# EAGLE design sensorCO2LinearSupply (EAGLE 6.6.0)
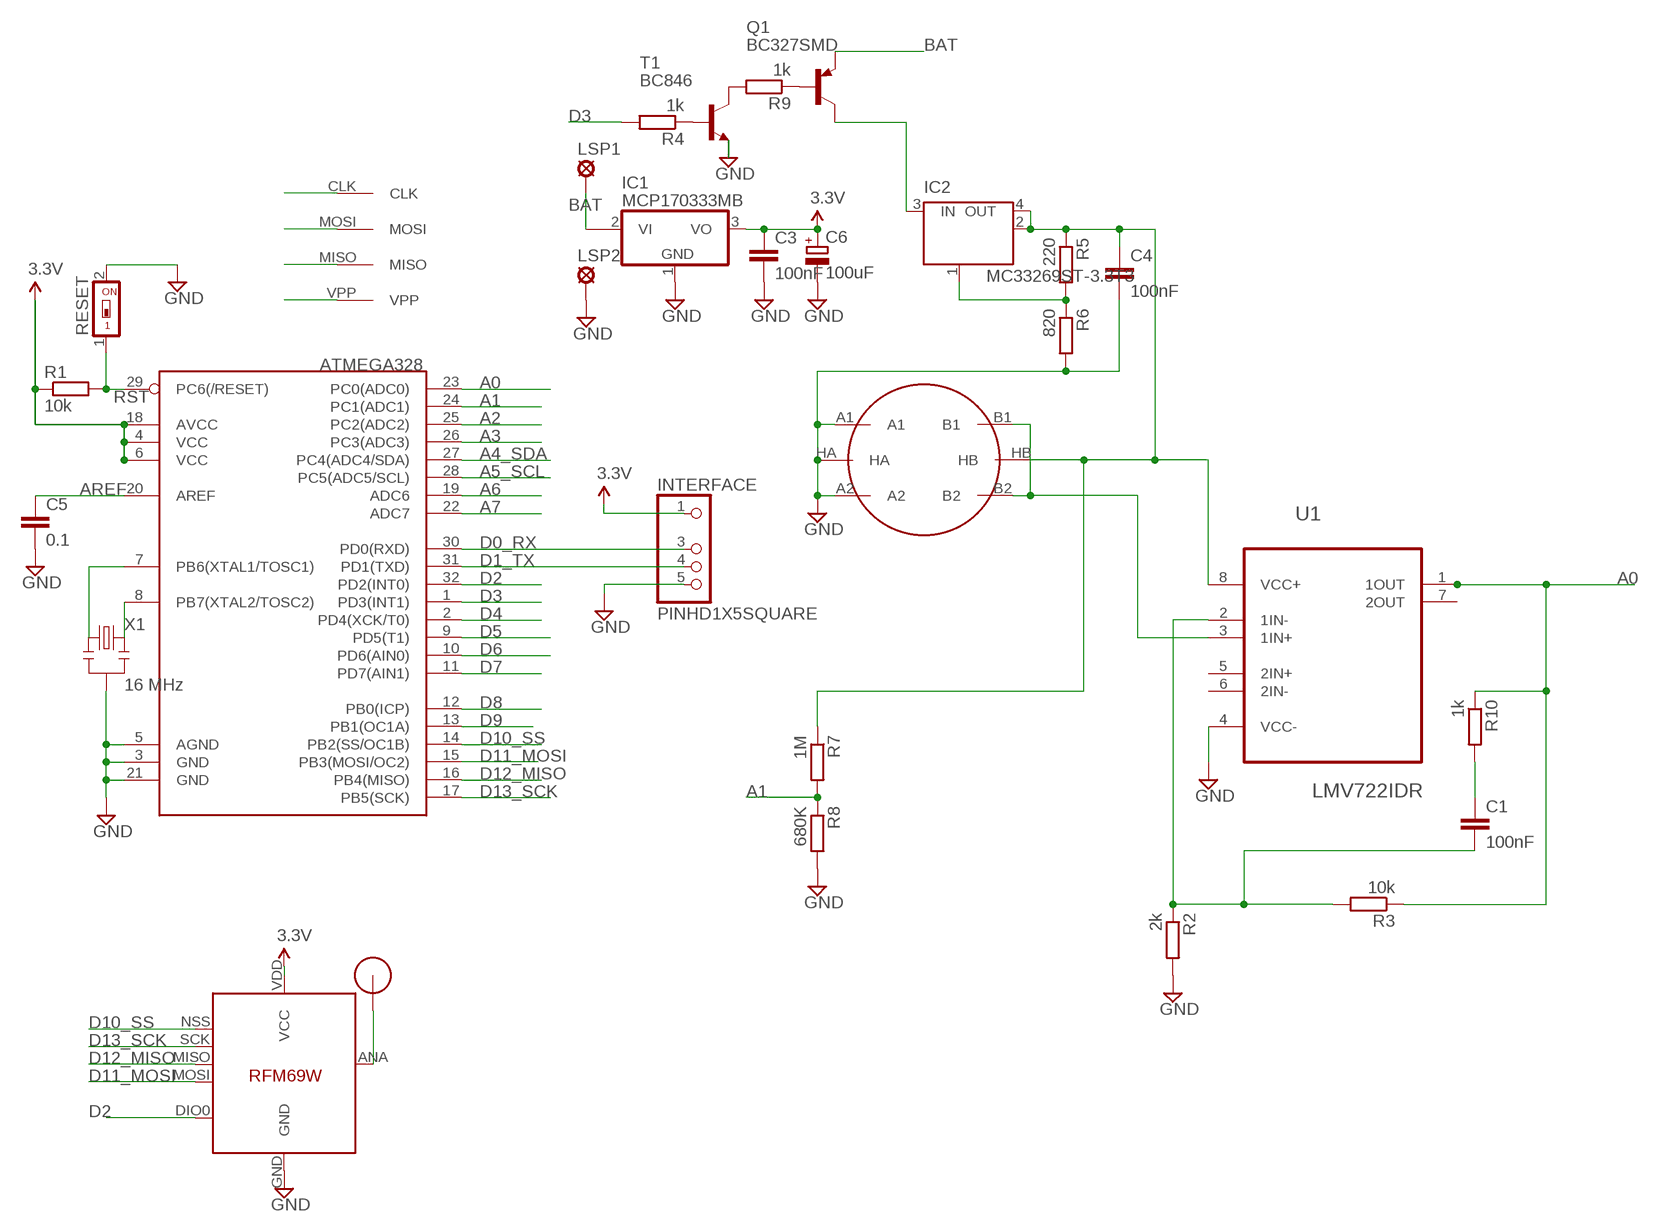
[diagram p0: schematic, sheet 1]

## Parts
ATMEGA328  ATMega-328  ATMEGA168/328TQFP32  [TQFP32-08]
C1  100nF  C-EUC2012  [C2012]
C3  100nF  C-EUC2012  [C2012]
C4  100nF  C-EUC2012  [C2012]
C5  0.1  C-EUC2012  [C2012]
C6  100uF  CPOL-EUSMCB  [SMC_B]
IC1  MCP170333MB  [SOT89]
IC2  MC33269ST-3.3T3  [SOT223]
IC4  RFM69  [RFM69W-MINPADS]
INTERFACE  PINHD1X5SQUARE  [PINHD1X05-SQUARE]
LSP1  LSP11  [LSP11]
LSP2  LSP11  [LSP11]
Q1  BC327SMD  [SOT23-BEC]
R1  10k  R-EU_R2012  [R2012]
R2  2k  R-EU_R2012  [R2012]
R3  10k  R-EU_R2012  [R2012]
R4  1k  R-EU_R2012  [R2012]
R5  220  R-EU_R2012  [R2012]
R6  820  R-EU_R2012  [R2012]
R7  1M  R-EU_R2012  [R2012]
R8  680K  R-EU_R2012  [R2012]
R9  1k  R-EU_R2012  [R2012]
R10  1k  R-EU_R2012  [R2012]
RESET  SWS001  [SMS-001]
T1  BC846  [SOT23]
U1  LMV722IDR  [SOIC127P600X175-8N]
U$1  RFM12B_ANTENNA  [RFM12B-ANTENNA]
U$2  AVRHEADERDIP  [AVRHEADER]
U$4  METHANE_SENSOR  [MQ-3]
X1  16 MHz  RESONATORSMD  [RESONATOR-SMD]

## Nets
6V: C4.1 IC2.2(OUT) IC2.4(OUT) R5.1 R7.1 U1.8(VCC+) U$4.HB
A0: ATMEGA328.23(PC0(ADC0)) R3.1 R10.1 U1.1(1OUT)
A1: ATMEGA328.24(PC1(ADC1)) R7.2 R8.1
A2: ATMEGA328.25(PC2(ADC2))
A3: ATMEGA328.26(PC3(ADC3))
A4_SDA: ATMEGA328.27(PC4(ADC4/SDA))
A5_SCL: ATMEGA328.28(PC5(ADC5/SCL))
A6: ATMEGA328.19(ADC6)
A7: ATMEGA328.22(ADC7)
AREF: ATMEGA328.20(AREF) C5.1
BAT: IC1.2@1(VI1) LSP1.MP Q1.E
D0_RX: ATMEGA328.30(PD0(RXD)) INTERFACE.3
D1_TX: ATMEGA328.31(PD1(TXD)) INTERFACE.4
D2: ATMEGA328.32(PD2(INT0)) IC4.DIO0
D3: ATMEGA328.1(PD3(INT1)) R4.2
D4: ATMEGA328.2(PD4(XCK/T0))
D5: ATMEGA328.9(PD5(T1))
D6: ATMEGA328.10(PD6(AIN0))
D7: ATMEGA328.11(PD7(AIN1))
D8: ATMEGA328.12(PB0(ICP))
D9: ATMEGA328.13(PB1(OC1A))
D10_SS: ATMEGA328.14(PB2(SS/OC1B)) IC4.NSS(SEL)
D11_MOSI: ATMEGA328.15(PB3(MOSI/OC2)) IC4.MOSI U$2.MOSI
D12_MISO: ATMEGA328.16(PB4(MISO)) IC4.MISO U$2.MISO
D13_SCK: ATMEGA328.17(PB5(SCK)) IC4.SCK U$2.CLK
GND: ATMEGA328.3(GND) ATMEGA328.5(AGND) ATMEGA328.21(GND) C3.2 C4.2 C5.2 C6.- IC1.1(GND) IC4.GND INTERFACE.5 LSP2.MP R2.2 R6.2 R8.2 RESET.2 T1.2(E) U1.4(VCC-) U$4.A1 U$4.A2 U$4.HA X1.2
N$1: ATMEGA328.7(PB6(XTAL1/TOSC1)) X1.1
N$2: IC2.1(GND/ADJ) R5.2 R6.1
N$3: IC4.ANA(ANT) U$1.P$1
N$4: IC2.3(IN) Q1.C
N$6: C1.1 R10.2
N$7: U1.3(1IN+) U$4.B1 U$4.B2
N$8: R4.1 T1.1(B)
N$9: R9.2 T1.3(C)
N$10: Q1.B R9.1
N$11: C1.2 R2.1 R3.2 U1.2(1IN-)
N$21: ATMEGA328.8(PB7(XTAL2/TOSC2)) X1.3
RST: ATMEGA328.29(PC6(/RESET)) R1.2 RESET.1 U$2.VPP
VCC: ATMEGA328.4(VCC) ATMEGA328.6(VCC) ATMEGA328.18(AVCC) C3.1 C6.+ IC1.3(VO) IC4.VDD(VCC) INTERFACE.1 R1.1 ; supply symbol labelled 3.3V
Unconnected: IC1.2(VI) U1.5(2IN+) U1.6(2IN-) U1.7(2OUT)

## Library data of the parts
ATMEGA328 = LowPowerLab:ATMEGA168/328: Atmel 32-pin 8-bit micro, 16k flash.
C1 C3-C5 = resistor:C-EU: CAPACITOR, European symbol
C6 = resistor:CPOL-EU: POLARIZED CAPACITOR, European symbol
IC1 = linear:MCP1703*: 250 mA, 16V, Low Quiescent Current LDO Regulator Source: http://ww1.microchip.com/downloads/en/DeviceDoc/22049b.pdf
IC2 = linear:MC33269ST*: Adjustable Output Low Dropout Voltage Regulator 800 mA Source: http://www.onsemi.com/pub/Collateral/MC33269-D.PDF
IC4 = LowPowerLab:RFM69
INTERFACE = eagle-library-edeca.net-v5:PINHD1X5
LSP1 LSP2 = solpad:LSP11: SOLDER PAD drill 1.1 mm
Q1 = transistor-pnp:BC327*: PNP Transistror
R1-R10 = resistor:R-EU_: RESISTOR, European symbol
RESET = smd-special:SWS001: SMD Dip Switch 1 pol.
T1 = transistor:BC846: NPN TRANSISTOR
U1 = Texas Instruments_By_element14_Batch_1:LMV722IDR: OPERATIONAL AMPLIFIERS; MPN: LMV722IDR; OC_FARNELL: -; OC_NEWARK: 02M3640; PACKAGE: SOIC-8; SUPPLIER: Texas Instruments
U$1 = LowPowerLab:RFM12B_ANTENNA
U$2 = RemoteHome:AVRHEADER
U$4 = SparkFun-Sensors:METHANE_SENSOR: MQ-4 Methane Gas Sensor SEN-09404
X1 = SparkFun:RESONATOR: Resonator Small SMD resonator. This is the itty bitty 10/20MHz resonators with built in caps. CSTCE10M0G55 and CSTCE20M0V53. Footprint has been reviewed closely but hasn't been tested yet.

## Net classes
1 power: width 0.381 mm, clearance 0.254 mm

## Board
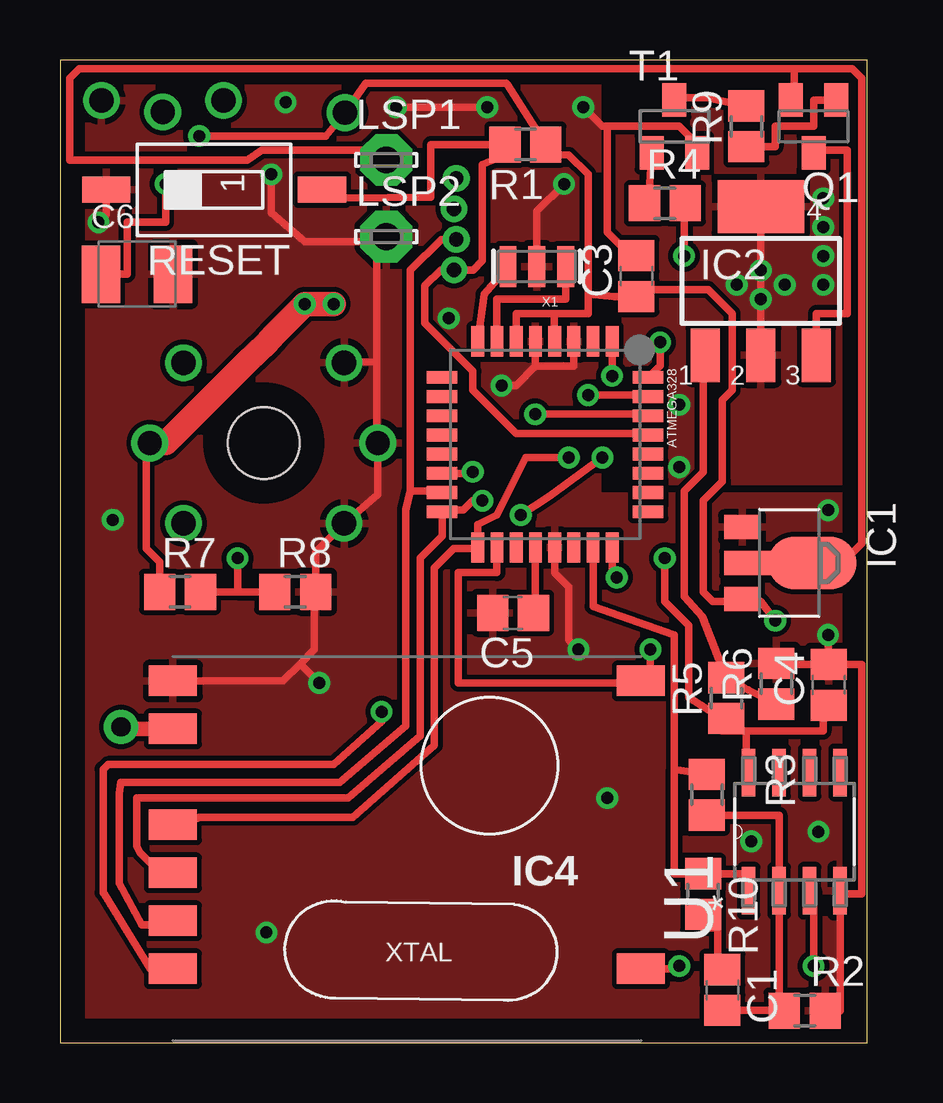
[diagram p1: board, top side]
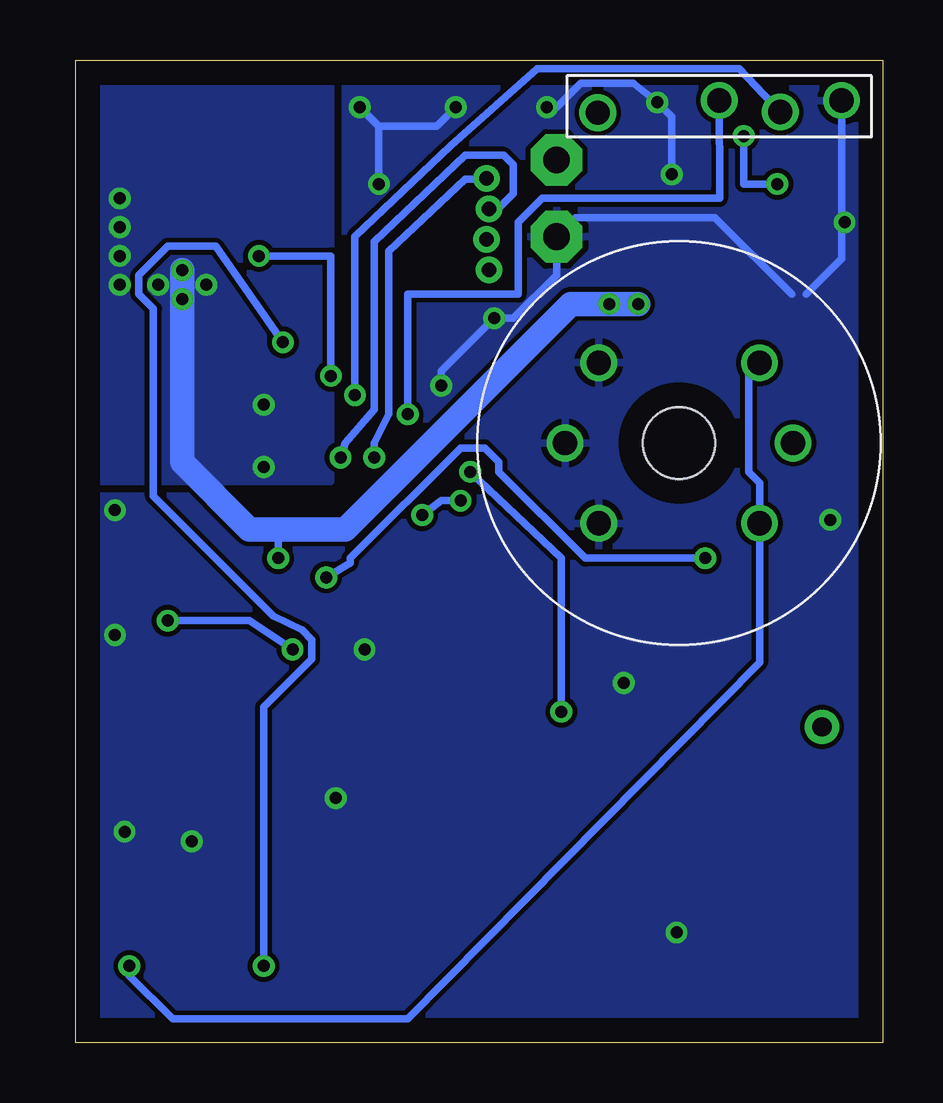
[diagram p2: board, bottom side, seen from below]

Size 33.63 x 40.97 mm. Coordinates in mm from the lower left corner, seen from the top.
Outline: 0,0 33.63,0 33.63,40.97 0,40.97 0,0
Copper layers (1*16): Top 0.035mm / dielectric 1.5mm / Bottom 0.035mm
Design rules "default": minimum track width 10mil, minimum drill 24mil, track to track 8mil, track to pad 8mil, pad to pad 8mil, via to via 8mil, smd to smd 8mil, copper to edge 40mil, drill to drill 8mil, minimum pad ring 10mil, minimum via ring 8mil, stop-mask expansion 4mil, vias tented up to drill 0mil, thermal gap 10mil

### Footprints (pad centres in the part's own frame; a part is rotated, then mirrored left to right if it is on the bottom)
TQFP32-08 = smd 1.27 x 0.533: 1 -4.293,2.8; 2 -4.293,2; 3 -4.293,1.2; 4 -4.293,0.4; 5 -4.293,-0.4; 6 -4.293,-1.2; 7 -4.293,-2; 8 -4.293,-2.8; 17 4.293,-2.8; 18 4.293,-2; 19 4.293,-1.2; 20 4.293,-0.4; 21 4.293,0.4; 22 4.293,1.2; 23 4.293,2; 24 4.293,2.8 | smd 0.533 x 1.27: 9 -2.8,-4.293; 10 -2,-4.293; 11 -1.2,-4.293; 12 -0.4,-4.293; 13 0.4,-4.293; 14 1.2,-4.293; 15 2,-4.293; 16 2.8,-4.293; 25 2.8,4.293; 26 2,4.293; 27 1.2,4.293; 28 0.4,4.293; 29 -0.4,4.293; 30 -1.2,4.293; 31 -2,4.293; 32 -2.8,4.293
C2012 = smd 1.3 x 1.5: 1 -0.85,0; 2 0.85,0
SMC_B = smd 1.6 x 2.4: + -1.5,0; - 1.5,0
SOT89 = smd 1 x 1.5: 1 -1.499,-1.981; 3 1.499,-1.981 | smd 1 x 2: 2 0,-1.727 | smd 2.2 x 3.7: 2@1 0,0.94
SOT223 = smd 1.219 x 2.235: 1 -2.311,-3.099; 2 0,-3.099; 3 2.311,-3.099 | smd 3.6 x 2.2: 4 0,3.099
RFM69W-MINPADS = smd 2 x 1.27: ANA 8,-5; DIO0 -11.5,5; GND 8,-7; MISO 8,1; MOSI 8,3; NSS 8,5; SCK 8,-1; VDD -11.5,-7
PINHD1X05-SQUARE = drill 1.016: 1 -5.061,-0.269; 3 0,0.24; 4 2.54,-0.24; 5 5.099,0.24
LSP11 = drill 1.118 pad 2.159 octagon: MP 0,0
SOT23-BEC = smd 1 x 1.4: B -0.95,-1.1; C 0,1.1; E 0.95,-1.1
R2012 = smd 1.3 x 1.5: 1 -0.85,0; 2 0.85,0
SMS-001 = smd 1.092 x 2.007: 1 0,-4.496; 2 0,4.496
SOT23 = smd 1 x 1.4: 1 -0.95,-1.1; 2 0.95,-1.1; 3 0,1.1
SOIC127P600X175-8N = smd 1.981 x 0.559: 1 -2.464,1.905; 2 -2.464,0.635; 3 -2.464,-0.635; 4 -2.464,-1.905; 5 2.464,-1.905; 6 2.464,-0.635; 7 2.464,0.635; 8 2.464,1.905
RFM12B-ANTENNA = drill 0.8 pad 1.422: P$1 0,0
AVRHEADER = drill 0.6 pad 0.813: CLK 2.54,0; MISO 1.27,0.091; MOSI 0,0; VPP -1.27,0.099
MQ-3 = drill 1.016: A1 -3.35,3.35; A2 -3.35,-3.35; B1 3.35,3.35; B2 3.35,-3.35; HA -4.75,0; HB 4.75,0 | hole 3: 0,0
RESONATOR-SMD = smd 0.7 x 1.7: 1 -1.2,0; 2 0,0; 3 1.2,0

### Placement (x,y rotation side)
ATMEGA328  20.21,24.94 270 top
C1  27.6,2.2 270 top
C3  24.02,31.96 90 top
C4  32.03,14.92 90 top
C5  18.88,17.92 180 top
C6  3.21,32.04 0 top
IC1  30.4,20 270 top
IC2  29.2,31.76 0 top
IC4  12.7,8.09 180 top
INTERFACE  6.82,39.04 0 bottom
LSP1  13.6,36.8 0 top
LSP2  13.6,33.6 0 top
Q1  31.4,38.2 180 top
R1  19.39,37.44 180 top
R2  31.03,1.34 0 top
R3  26.95,10.34 270 top
R4  25.2,35 0 top
R5  27.77,14.37 90 top
R6  29.85,14.97 90 top
R7  5,18.8 0 top
R8  9.8,18.8 0 top
R9  28.6,38.2 90 top
R10  26.8,6.2 270 top
RESET  6.42,35.56 90 top
T1  25.6,38.2 0 top
U1  30.6,8.8 90 top
U$1  2.54,13.17 0 top
U$2  16.51,33.49 90 top
U$4  8.49,25 0 bottom
X1  19.87,32.36 180 top

### Tracks (layer width: path | path; a pad name or v marks a point on that pad's centre or on a via)
6V  (via drill 0.5)
  Top 0.305: IC2.2 v29.2,31 v29.2,32.2 IC2.4 | C4.1 31.8,14.07 31.8,13 28.6,13 | 28.6,13 27.57,13 R5.1 27.28,13.72 26.2,14.4 26.2,17.4 25.2,18.4 v25.2,20.2 | U1.8 28.6,11.26 28.6,13 | R7.1 4.15,20.05 3.6,20.6 3.6,24.86 U$4.HB
  Top 1.016: v11.4,30.8 v10.2,30.8 8.95,29.55 8.6,29.15 7.8,28.4 4.4,25 U$4.HB
  Bottom 0.305: v25.2,20.2 25.2,21.4
  Bottom 1.016: v29.2,32.2 v29.2,31 29.2,24.2 26.4,21.4 25.2,21.4 22.4,21.4 13,30.8 v11.4,30.8 v10.2,30.8
  other vias: 28.2,31.6 30.2,31.6 31.8,35.2 31.8,34 31.8,32.8 31.8,31.6 25.8,26.6 25.8,24
  pour Top: 23,23.4 33.4,23.4 33.4,40.8 23,40.8
  pour Bottom: 33.4,40.8 23,40.8 23,23.4 33.4,23.4
A0
  Top 0.305: ATMEGA328.23 22.21,18.19 25.6,17 25.6,11.39 | R3.1 25.6,11.39 | 25.6,11.39 25.6,7.05 R10.1 28.7,7.05 U1.1
A1  (via drill 0.5)
  Top 0.305: 7.4,18.8 R7.2 | ATMEGA328.24 23.01,20.61 23,20.6 23,19.2 v23.2,19.4 | v7.4,20.2 7.4,18.8 | 7.4,18.8 R8.1
  Bottom 0.305: v7.4,20.2 12.4,20.2 16,23.8 16,24.2 16.6,24.8 17.6,24.8 22.2,20.2 22.2,20 v23.2,19.4
AREF
  Top 0.305: C5.1 19.81,18.12 ATMEGA328.20
BAT
  Top 0.305: LSP1.MP 13.6,37.2 8.4,37.2 7.8,36.8 0.4,36.8 0.4,40.2 0.8,40.6 30.6,40.6 | 30.6,40.6 33,40.6 33.4,40.2 33.4,20.81 32.59,20 IC1.2@1 | Q1.E 30.6,39.3 30.6,40.6
D0_RX  (via drill 0.5)
  Top 0.305: v19.8,26.2 24.5,26.2 ATMEGA328.30
  Bottom 0.305: INTERFACE.3 6.8,35.57 6.8,35.2 14.2,35.2 15.2,34.2 15.2,31.2 19.8,31.2 v19.8,26.2
D1_TX  (via drill 0.5)
  Top 0.305: v22,27 24.5,27 ATMEGA328.31
  Bottom 0.305: INTERFACE.4 5.99,40.6 14.4,40.6 18,37.4 22,33.6 v22,27
D2  (via drill 0.5)
  Top 0.305: IC4.DIO0 25.71,3.09 v25.8,3.2 | v25,29.2 25,28.24 ATMEGA328.32
  Bottom 0.305: v25.8,3.2 25.8,14 23.8,16 23.8,16.8 24.2,17.2 25.4,17.8 30.4,22.8 30.4,30.6 31,31.2 31,32 29.8,33.2 27.8,33.2 v25,29.2
D3  (via drill 0.5)
  Top 0.305: ATMEGA328.1 23.01,28.01 v23,27.8 | R4.2 26,35 v26,32.8
  Bottom 0.305: v26,32.8 23,32.8 v23,27.8
D10_SS  (via drill 0.5)
  Top 0.305: IC4.NSS 3.77,3.09 1.83,6.22 1.8,6.25 1.8,11.4 2,11.6 11.4,11.6 13.4,13.4 v13.4,13.8 | ATMEGA328.14 16.94,23.74 v17.2,23.8
  Bottom 0.305: v17.2,23.8 13.4,20.2 v13.4,13.8
D11_MOSI
  Top 0.305: IC4.MOSI 4.62,5.09 4.45,4.92 3.41,4.92 2.47,6.66 2.47,10.39 2.54,10.87 11.66,10.87 14.4,13.2 14.4,22.2 14.6,23 | U$2.MOSI 15.89,33.49 14.6,32.2 14.6,23 | 14.6,23 15.86,23 ATMEGA328.15
D12_MISO  (via drill 0.5)
  Top 0.305: IC4.MISO 4.17,7.09 3.34,7.92 3.2,8.19 3.2,10.2 12,10.2 15,12.8 15,20.2 15.92,21.12 ATMEGA328.16 15.98,22.2 16.8,22.2 17.2,22.6 v17.6,22.6 | v19.2,22 20.4,22.8 v22.6,24.4
  Bottom 0.305: U$2.MISO 16.04,34.76 15.4,35.4 15.4,36.6 15.8,37 17.4,37 21.2,33.4 21.2,26.4 22.4,25 v22.6,24.4 | v17.6,22.6 18.4,22.6 v19.2,22
D13_SCK  (via drill 0.5)
  Top 0.305: 5,9.09 IC4.SCK 4.79,9 5.8,9.4 12.2,9.4 15.6,12.4 15.6,19.8 16.4,20.6 17.36,20.6 ATMEGA328.17 17.41,21.61 18.2,22 19.4,24.4 v21.2,24.4
  Bottom 0.305: v21.2,24.4 21.2,25 20.6,26.2 20.6,33 17.4,36 16.54,36 U$2.CLK
GND  (via drill 0.5)
  Top 0.305: 13.2,28.39 13.2,25.04 U$4.HA 13.24,22.85 U$4.A2 10.65,20.46 R8.2 10.6,18.75 10.6,16.4 10,15.8 | C4.2 29.65,15.77 | C4.2 33.4,15.77 33.4,6.2 32.51,6.2 U1.4 32.51,1.34 R2.2 | v32,17 32,16.2 C4.2 | C6.- 4.04,32.04 | RESET.2 1.92,34.52 v1.6,34.2 | IC4.GND 9.29,15.09 10,15.8 | ATMEGA328.3 21.41,28.21 21.4,28.2 19.8,28.2 | 19.8,28.2 ATMEGA328.5 | v18.4,27.4 19,27.4 19.8,28.2 | 13.2,28.39 U$4.A1 | 13.2,28.39 13.2,33.2 LSP2.MP 13.4,33.4 10.2,33.4 8.8,34.6 v8.8,36.2 | X1.2 19.87,34.67 v21,35.8 | v17.8,39 v14,39 | C3.2 23.79,32.81 22.8,33.8 22.8,38.2 | T1.2 26.55,37.45 25.8,38.2 22.8,38.2 | 22.8,38.2 22.6,38.2 v21.8,39 | v10.8,15 10,15.8 | ATMEGA328.21 20.61,19.59 21.2,19 21.2,16.8 v21.6,16.4
  Top 0.406: 29.65,15.77 R6.2
  Bottom 0.305: v18.4,27.4 18.4,28 v16.2,30.2 15.4,30.2 13.6,32 LSP2.MP 12.8,34.4 7,34.4 3.8,31.2 | v21,35.8 21,38.2 | 21,38.2 v21.8,39 | 21,38.2 18.6,38.2 v17.8,39 | v14,39 13.6,39 12.6,40 10.4,40 v9.4,39.2 8.8,38.6 v8.8,36.2 | INTERFACE.5 1.72,34.32 | 1.72,34.32 v1.6,34.2 | 1.72,34.32 1.72,32.68 3.2,31.2
  other vias: 32,22.2 31.6,8.8 28.8,8.4 22.8,10.2 8.6,4.6 2.2,21.8
  pour Bottom: 0.2,40.8 22.4,40.8 22.4,22.8 33.4,22.8 33.4,0.2 0.2,0.2
  pour Top: 33.4,0.2 0.2,0.2 0.2,40.8 22.4,40.8 22.4,22.8 33.4,22.8
N$1
  Top 0.305: ATMEGA328.7 18.2,31 21.07,31 X1.1
N$2
  Top 0.305: R6.1 28.67,14.72 R5.2 26.77,17.77 26.2,18.4 26,18.6 26,23 26.8,23.8 26.8,28.17 IC2.1
N$3
  Top 0.61: IC4.ANA 2.62,13.09 U$1.P$1
N$4
  Top 0.305: Q1.C 31.4,37.2 32.8,37.2 32.8,30.4 31.51,30.4 IC2.3
N$6
  Top 0.305: C1.1 27.4,3.05 27.4,4.8 26.8,4.8 R10.2
N$7  (via drill 0.5)
  Top 0.305: U1.3 31.4,6.34 v31.4,3.2
  Bottom 0.305: v31.4,3.2 31.4,2.8 29.6,1 19.8,1 5.14,15.86 U$4.B2 5.14,23.34 5.6,23.8 5.6,27.89 U$4.B1
N$8
  Top 0.305: T1.1 24.55,35.5 R4.1
N$9
  Top 0.305: T1.3 25.6,39.4 26.95,39.4 R9.2
N$10
  Top 0.305: Q1.B 31.4,39.3 31.4,38.2 29.8,38.2 29.8,37.35 R9.1
N$11
  Top 0.305: R3.2 29.96,9.49 U1.2 29.96,1.34 R2.1 C1.2
N$21
  Top 0.305: X1.3 17.67,31.21 ATMEGA328.8
RST
  Top 0.305: U$2.VPP 15.86,32.22 15.2,31.56 15.2,30 17.2,28 17.2,27.2 19,25.4 24.44,25.4 ATMEGA328.29 | RESET.1 11.8,35.2 15.46,35.26 15.46,37.44 R1.2 18.4,37.18 18,36.8 17.6,36.6 17.6,32.6 17.22,32.22 U$2.VPP | 16.43,32.24 U$2.VPP
VCC  (via drill 0.5)
  Top 0.305: ATMEGA328.18 18.2,19.6 16.6,19.6 16.6,15 24.2,15 IC4.VDD 24.6,15.49 v24.6,16.4 | ATMEGA328.6 19,30.4 20.6,30.4 | 20.6,30.4 20.6,29.24 ATMEGA328.4 | 20.6,30.4 22,30.4 22,31.2 | 22,31.2 22,36.2 21.2,37 20.56,37.04 R1.1 18.64,39.96 18.6,40 12.73,40 INTERFACE.1 11.08,37.8 v5.8,37.8 | 22,31.2 23.09,31.11 C3.1 24.13,31.4 27,31.4 28,30.4 28,27.2 27.6,26.8 27.6,23.4 26.8,22.6 26.8,18.8 27.2,18.4 28.32,18.4 | C6.+ 2.8,32.04 2.8,34.2 4.4,34.2 v4.4,35.8 | 28.32,18.4 IC1.3 | 28.32,18.4 29.2,18.4 v29.8,17.6
  Bottom 0.305: v29.8,17.6 26.4,17.6 v24.6,16.4 | v4.4,35.8 5.8,35.8 v5.8,37.8